# EAGLE design alles-pro (EAGLE 9.5.2)
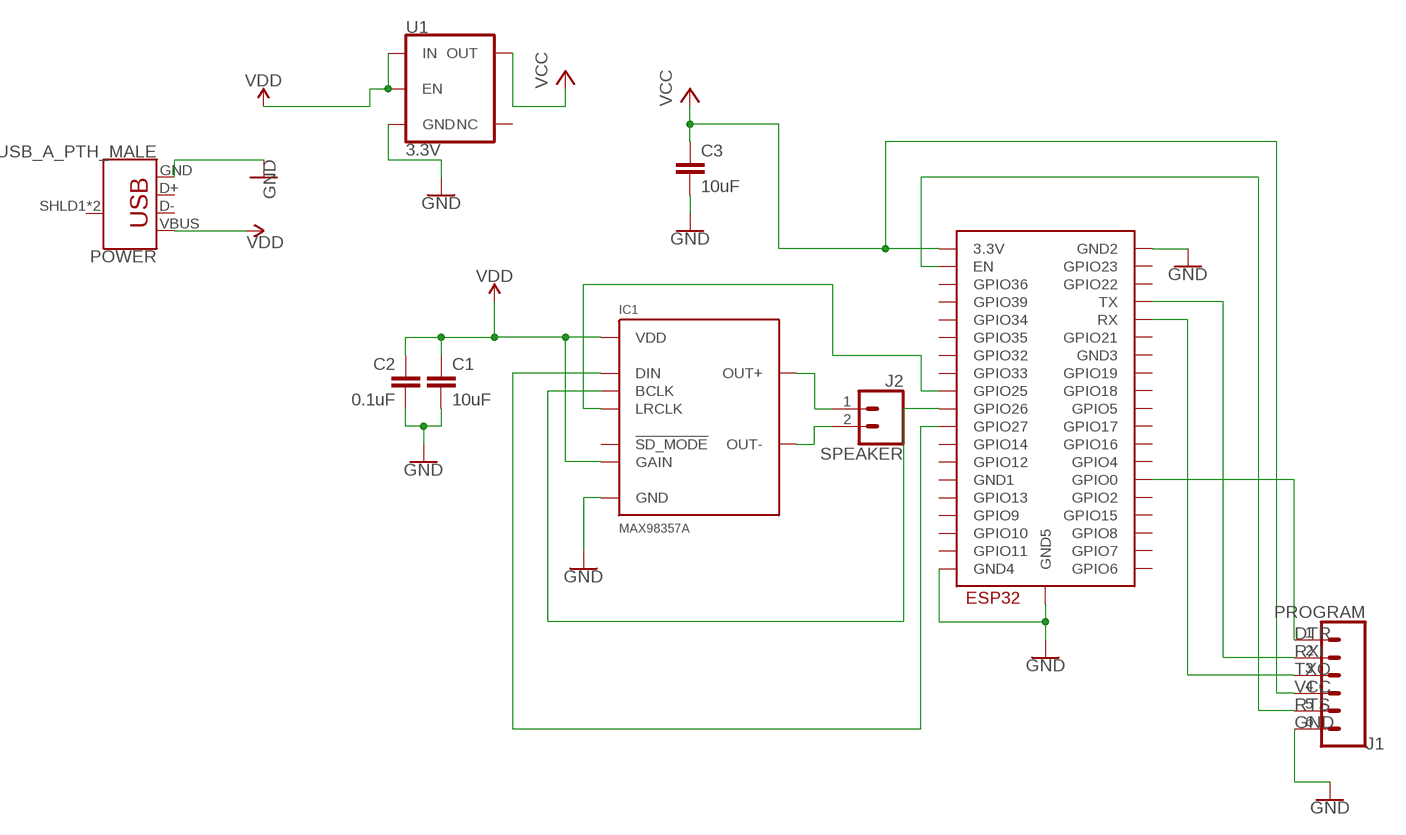
[diagram p0: schematic, sheet 1]

## Parts
C1  10uF  10UF-0805-10V-10%  [0805]
C2  0.1uF  0.1UF-0603-25V-(+80/-20%)  [0603]
C3  10uF  10UF-0603-6.3V-20%  [0603]
IC1  MAX98357A  [TQFN-16]
J1  PROGRAM  CONN_06SILK_FEMALE_PTH  [1X06]
POWER  USB_A_PTH_MALE  [USB-A-H]
SPEAKER  J2  CONN_023.5MM-NO_SILK  [SCREWTERMINAL-3.5MM-2-NS]
U1  3.3V  V_REG_AP2112K-3.3V  [SOT23-5]
U$21  ESP32-WROOM  [ESP32-WROOM]

## Nets
BCLK: IC1.P$16(BCLK) U$21.IO26(GPIO26)
DIN: IC1.P$1(DIN) U$21.IO27(GPIO27)
DTR: J1.1 U$21.IO0(GPIO0)
GND: C1.2 C2.2 C3.2 IC1.P$3(GND) IC1.P$11(GND) IC1.P$15(GND) IC1.P$EP(GND) J1.6 POWER.GND U1.2(GND) U$21.GND2 U$21.GND4 U$21.GND5
LRCLK: IC1.P$14(LRCLK) U$21.IO25(GPIO25)
OUT+: IC1.P$9(OUT+) SPEAKER.1
OUT-: IC1.P$10(OUT-) SPEAKER.2
RTS: J1.5 U$21.EN
RXI: J1.2 U$21.TX
TXO: J1.3 U$21.RX
VCC: C3.1 J1.4 U1.5(OUT) U$21.3V3(3.3V)
VDD: C1.1 C2.1 IC1.P$2(GAIN) IC1.P$7(VDD) IC1.P$8(VDD) POWER.VBUS U1.1(IN) U1.3(EN)
Unconnected: IC1.P$4(!SD_MODE) POWER.D+ POWER.D- POWER.SHLD1(SHIELD) POWER.SHLD2(SHIELD) U1.4(NC) U$21.CLK(GPIO6) U$21.CMD(GPIO11) U$21.GND1 U$21.GND3 U$21.IO2(GPIO2) U$21.IO4(GPIO4) U$21.IO5(GPIO5) U$21.IO12(GPIO12) U$21.IO13(GPIO13) U$21.IO14(GPIO14) U$21.IO15(GPIO15) U$21.IO16(GPIO16) U$21.IO17(GPIO17) U$21.IO18(GPIO18) U$21.IO19(GPIO19) U$21.IO21(GPIO21) U$21.IO22(GPIO22) U$21.IO23(GPIO23) U$21.IO32(GPIO32) U$21.IO33(GPIO33) U$21.IO34(GPIO34) U$21.IO35(GPIO35) U$21.SD0(GPIO7) U$21.SD1(GPIO8) U$21.SD2(GPIO9) U$21.SD3(GPIO10) U$21.SENSOR_VN(GPIO39) U$21.SENSOR_VP(GPIO36)

## Library data of the parts
C1 = SparkFun-Capacitors:10UF: 10.0µF ceramic capacitors A capacitor is a passive two-terminal electrical component used to store electrical energy temporarily in an electric field.; PROD_ID: CAP-11330
C2 = SparkFun-Capacitors:0.1UF: 0.1µF ceramic capacitors A capacitor is a passive two-terminal electrical component used to store electrical energy temporarily in an electric field.; PROD_ID: CAP-00810
C3 = SparkFun-Capacitors:10UF: 10.0µF ceramic capacitors A capacitor is a passive two-terminal electrical component used to store electrical energy temporarily in an electric field.; PROD_ID: CAP-11015
IC1 = SparkFun-IC-Amplifiers:MAX98357A: I2S DAC 3.2W (4-8ohm); PROD_ID: IC-14032
J1 = SparkFun-Connectors:CONN_06: Multi connection point. Often used as Generic Header-pin footprint for 0.1 inch spaced/style header connections On any of the 0.1 inch spaced packages, you can populate with these: Break Away Headers - Straight <https://www.sparkfun.com/products/116> (PRT-00116) Break Away Male Headers - Right Angle <https://www.sparkfun.com/products/553> (PRT-00553) Female Headers <https://www.sparkfun.com/products/115> (PRT-00115) Break Away Headers - Machine Pin <https://www.sparkfun.com/products/117> (PRT-00117) Break Away Female Headers - Swiss Machine Pin <https://www.sparkfun.com/products/743> (PRT-00743) Arduino Stackable Header - 6 Pin <https://www.sparkfun.com/products/9280> (PRT-09280) For SCREWTERMINALS and SPRING TERMINALS visit here: Screw Terimnals on SparkFun.com <https://www.sparkfun.com/search/results?term=Screw+Terminals> (5mm/3.5mm/2.54mm spacing) This device is also useful as a general connection point to wire up your design to another part of your project. Our various solder wires solder well into these plated through hole pads. Hook-Up Wire - Assortment (Stranded, 22 AWG) <https://www.sparkfun.com/products/11375> (PRT-11375) Hook-Up Wire - Assortment (Solid Core, 22 AWG) <https://www.sparkfun.com/products/11367> (PRT-11367) View the entire wire category on our website here <https://www.sparkfun.com/categories/141>; PROD_ID: CONN-08437
POWER = SparkFun-Connectors:USB_A: USB-A Connector Male and female variants, as well as PTH and SMT variants SparkFun Products: SparkFun XBee Explorer Dongle <https://www.sparkfun.com/products/11697> PTH Male SparkFun MicroView-USB Programmer <https://www.sparkfun.com/products/12924> SMT Male SparkFun USB Type A Female Breakout <https://www.sparkfun.com/products/12700> SMT Female; PROD_ID: CONN-08367; SF_ID: PRT-00437
SPEAKER = SparkFun-Connectors:CONN_02: Multi connection point. Often used as Generic Header-pin footprint for 0.1 inch spaced/style header connections On any of the 0.1 inch spaced packages, you can populate with these: Break Away Headers - Straight <https://www.sparkfun.com/products/116> (PRT-00116) Break Away Male Headers - Right Angle <https://www.sparkfun.com/products/553> (PRT-00553) Female Headers <https://www.sparkfun.com/products/115> (PRT-00115) Break Away Headers - Machine Pin <https://www.sparkfun.com/products/117> (PRT-00117) Break Away Female Headers - Swiss Machine Pin <https://www.sparkfun.com/products/743> (PRT-00743) For SCREWTERMINALS and SPRING TERMINALS visit here: Screw Terimnals on SparkFun.com <https://www.sparkfun.com/search/results?term=Screw+Terminals> (5mm/3.5mm/2.54mm spacing) This device is also useful as a general connection point to wire up your design to another part of your project. Our various solder wires solder well into these plated through hole pads. Hook-Up Wire - Assortment (Stranded, 22 AWG) <https://www.sparkfun.com/products/11375> (PRT-11375) Hook-Up Wire - Assortment (Solid Core, 22 AWG) <https://www.sparkfun.com/products/11367> (PRT-11367) View the entire wire category on our website here <https://www.sparkfun.com/categories/141> Special notes: Molex polarized connector foot print use with: PRT-08233 with associated crimp pins and housings. 2.54_SCREWTERM for use with PRT-10571. 3.5mm Screw Terminal footprints for PRT-08084 5mm Screw Terminal footprints for use with PRT-08432; PROD_ID: CONN-08399
U1 = SparkFun-IC-Power:V_REG_AP2112: AP2112 - 600mA CMOS LDO Regulator w/ Enable The AP2112 is CMOS process low dropout linear regulator with enable function, the regulator delivers a guaranteed 600mA (min.) continuous load current. Features Output Voltage Accuracy: ±1.5% Output Current: 600mA (Min.) Foldback Short Current Protection: 50mA Enable Function to Turn ON/OFF VOUT Low Dropout Voltage (3.3V): 250mV (Typ.) @IOUT=600mA Excellent Load Regulation: 0.2%/A (Typ.) Excellent Line Regulation: 0.02%/V (Typ.) Low Quiescent Current: 55μA (Typ.) Low Standby Current: 0.01μA (Typ.) Low Output Noise: 50μVRMS PSRR: 100Hz -65dB, 1kHz -65dB OTSD Protection Stable with 1.0μF Flexible Cap: Ceramic, Tantalum and Aluminum Electrolytic Operation Temperature Range: -40°C to 85°C ESD: MM 400V, HBM 4000V; PROD_ID: VREG-12457
U$21 = ESP32:ESP32-WROOM

## Board
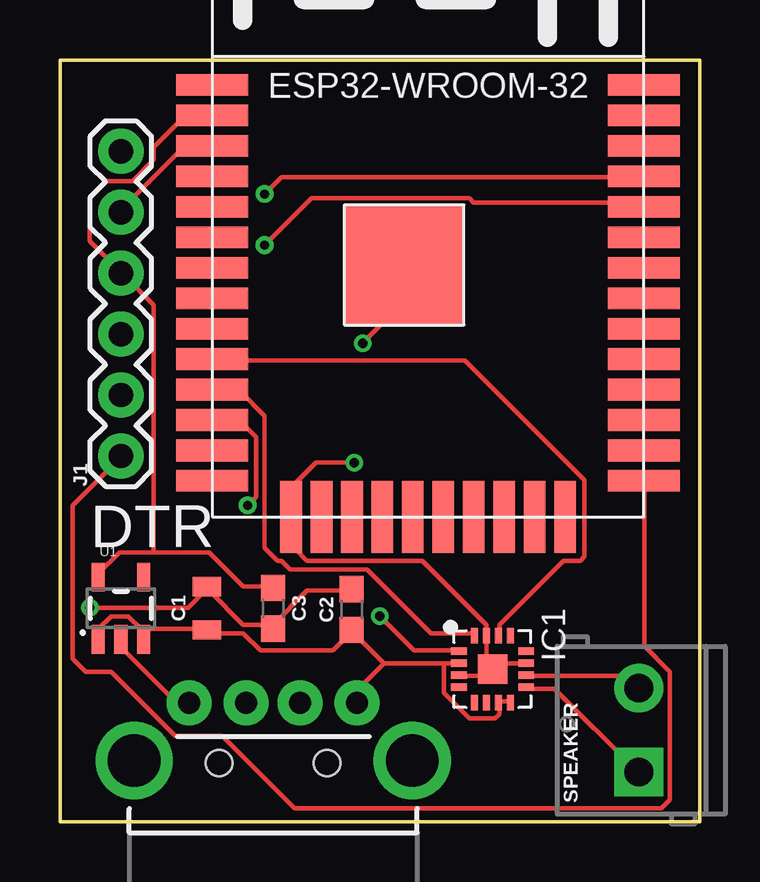
[diagram p1: board, top side]
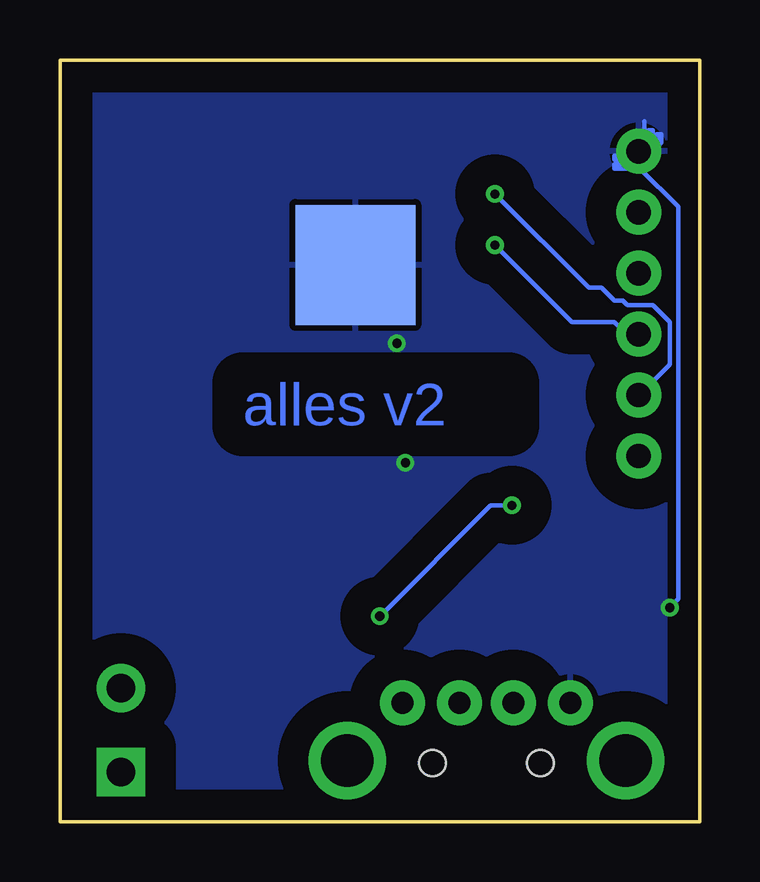
[diagram p2: board, bottom side, seen from below]

Size 26.67 x 31.75 mm. Coordinates in mm from the lower left corner, seen from the top.
Outline: 0,0 26.67,0 26.67,31.75 0,31.75 0,0
Copper layers (1*16): Top 0.035mm / dielectric 1.5mm / Bottom 0.035mm
Design rules "SparkFun-2-layer-TIGHT *": minimum track width 7mil, minimum drill 15mil, track to track 7mil, track to pad 7mil, pad to pad 7mil, via to via 7mil, smd to smd 7mil, copper to edge 7mil, drill to drill 7mil, minimum pad ring 7mil, minimum via ring 7mil, stop-mask expansion 4mil, vias tented up to drill 25mil, thermal gap 10mil

### Footprints (pad centres in the part's own frame; a part is rotated, then mirrored left to right if it is on the bottom)
0805 = smd 0.8 x 1.2: 1 -0.9,0; 2 0.9,0
0603 = smd 1.1 x 1: 1 -0.85,0; 2 0.85,0
TQFN-16 = smd 0.3 x 0.65: P$1 -0.75,-1.4; P$2 -0.25,-1.4; P$3 0.25,-1.4; P$4 0.75,-1.4; P$9 0.75,1.4; P$10 0.25,1.4; P$11 -0.25,1.4; P$12 -0.75,1.4 | smd 0.65 x 0.3: P$5 1.4,-0.75; P$6 1.4,-0.25; P$7 1.4,0.25; P$8 1.4,0.75; P$13 -1.4,0.75; P$14 -1.4,0.25; P$15 -1.4,-0.25; P$16 -1.4,-0.75 | smd 1.23 x 1.23: P$EP 0,0
1X06 = drill 1.016 pad 1.88: 1 0,0; 2 2.54,0; 3 5.08,0; 4 7.62,0; 5 10.16,0; 6 12.7,0
USB-A-H = drill 0.914 pad 1.88: D+ 2.4,1.127; D- 2.4,-1.127; GND 2.4,3.5; VBUS 2.4,-3.5 | drill 2.2: SHLD1 0,-5.8; SHLD2 0,5.8 | hole 1.1: -0.1,2.25; -0.1,-2.25
SCREWTERMINAL-3.5MM-2-NS = drill 1.2 pad 2.032 square: 1 0,0 | drill 1.2 pad 2.032: 2 3.5,0
SOT23-5 = smd 0.55 x 1.2: 1 -0.95,-1.3; 2 0,-1.3; 3 0.95,-1.3; 4 0.95,1.3; 5 -0.95,1.3
ESP32-WROOM = smd 3 x 0.9: 3V3 0,16.74; EN 0,15.47; GND1 0,18.01; GND3 18,18.01; IO0 18,1.5; IO4 18,2.77; IO5 18,6.58; IO12 0,1.5; IO14 0,2.77; IO16 18,4.04; IO17 18,5.31; IO18 18,7.85; IO19 18,9.12; IO21 18,11.66; IO22 18,15.47; IO23 18,16.74; IO25 0,6.58; IO26 0,5.31; IO27 0,4.04; IO32 0,9.12; IO33 0,7.85; IO34 0,11.66; IO35 0,10.39; NC 18,10.39; RX 18,12.93; SENSOR_VN 0,12.93; SENSOR_VP 0,14.2; TX 18,14.2 | smd 0.9 x 3: CLK 9.635,0; CMD 8.365,0; GND2 3.285,0; IO2 14.715,0; IO13 4.555,0; IO15 13.445,0; SD0 10.905,0; SD1 12.175,0; SD2 5.825,0; SD3 7.095,0 | smd 5 x 5: GND4 8,10.5 | smd 5 x 5 bottom: GND5 8,10.5

### Placement (x,y rotation side)
C1  6.12,8.89 90 top
C2  12.17,8.84 90 top
C3  8.89,8.89 270 top
IC1  18.03,6.35 270 top
J1  2.54,15.24 90 top
POWER  8.89,2.54 90 top
SPEAKER  24.13,2.06 90 top
U1  2.54,8.89 0 top
U$21  6.35,12.7 0 top

### Tracks (layer width: path | path; a pad name or v marks a point on that pad's centre or on a via)
BCLK
  Top 0.178: IC1.P$16 17.25,7.85 15.47,7.85 12.8,10.52 9.6,10.52 9.25,10.87 9.07,10.87 8.53,11.4 8.53,16.92 7.47,17.98 6.4,17.98 U$21.IO26
DIN  (via drill 0.38)
  Top 0.178: v13.34,8.56 14.76,7.14 16.54,7.14 IC1.P$1 | v7.82,13.18 8.18,13.54 8.18,16.03 7.47,16.74 6.4,16.74 U$21.IO27
  Bottom 0.178: v13.34,8.56 8.71,13.18 v7.82,13.18
DTR
  Top 0.178: U$21.IO0 24.36,14.07 24.36,7.32 25.43,6.25 25.43,0.91 25.07,0.56 9.78,0.56 6.76,3.58 4.8,3.58 2.13,6.25 1.07,6.25 0.53,6.78 0.53,13.18 2.49,15.14 J1.1
GND  (via drill 0.38)
  Top 0.178: IC1.P$3 16.71,6.07 17.78,6.07 17.96,6.25 IC1.P$EP | IC1.P$11 19.38,6.6 18.31,6.6 18.14,6.43 IC1.P$EP | IC1.P$EP 17.78,6.6 17.78,7.67 IC1.P$15 17.78,7.85 17.78,8.2 15.11,10.87 10.31,10.87 9.78,11.4 9.78,12.65 U$21.GND2 9.78,12.83 9.78,14.07 10.67,14.96 v12.27,14.96 | U1.2 2.67,7.49 2.67,7.14 4.8,5 5.33,5 POWER.GND | 8.89,8.2 7.64,8.2 6.22,9.63 C1.2 6.04,9.63 5.33,8.91 v1.25,8.91 | 8.89,8.2 10.31,9.63 12.09,9.63 C2.2 | 8.89,8.2 C3.2 | v12.62,19.94 14.22,21.54 14.22,23.14 U$21.GND4
  Bottom 0.178: v1.25,8.91 0.89,9.27 0.89,25.63 2.49,27.23 3.56,27.23 3.56,27.41 2.49,27.41 1.6,28.3 1.6,28.65 1.78,28.65 1.78,28.3 1.96,28.3 1.96,28.83 2.13,28.83 2.13,27.94 2.49,27.58 3.56,27.58 3.56,27.76 2.49,27.76 2.31,27.94 2.31,29.18 2.31,29.19
  pour Bottom (isolate 1.27): 0,31.75 26.67,31.75 26.67,0 0,0
LRCLK
  Top 0.178: IC1.P$14 18.31,7.85 18.31,8.2 20.98,10.87 21.69,10.87 21.87,11.05 21.87,14.25 16.89,19.23 6.4,19.23 U$21.IO25
OUT+
  Top 0.178: IC1.P$9 19.56,5.54 20.62,5.54 24,2.16 SPEAKER.1
OUT-
  Top 0.178: IC1.P$10 19.56,6.07 23.65,6.07 24,5.72 SPEAKER.2
RTS
  Top 0.178: U$21.EN 6.22,28.12 5.16,28.12 2.49,25.45 J1.5
RXI  (via drill 0.38)
  Top 0.178: v8.53,26.16 9.25,26.87 24.18,26.87 U$21.TX
  Bottom 0.178: v8.53,26.16 4.62,22.25 4.09,22.25 3.56,21.72 3.2,21.72 3.02,21.54 1.96,21.54 1.25,20.83 1.25,19.05 2.49,17.8 J1.2
TXO  (via drill 0.38)
  Top 0.178: v8.53,24.03 10.49,25.98 17.07,25.98 17.25,25.81 24.18,25.81 U$21.RX
  Bottom 0.178: v8.53,24.03 5.33,20.83 3.56,20.83 3.2,20.47 2.67,20.47 J1.3
VCC
  Top 0.178: 3.91,11.23 2.49,11.23 1.6,10.34 U1.5 | 3.91,11.23 6.22,11.23 7.64,9.8 8.89,9.8 C3.1 | U$21.3V3 6.22,29.36 5.16,29.36 3.91,28.12 3.91,27.58 3.02,26.69 1.96,26.69 1.25,25.98 1.25,24.21 2.49,22.96 J1.4 2.67,22.78 3.91,21.54 3.91,11.23
VDD
  Top 0.178: 3.38,8.03 2.85,8.56 2.13,8.56 1.6,8.03 1.6,7.67 U1.1 | 3.38,8.03 3.38,7.67 U1.3 3.38,8.03 | 3.38,8.03 6.04,8.03 C1.1 6.22,7.85 7.64,7.85 8.36,7.14 11.38,7.14 12.09,7.85 C2.1 12.27,7.85 13.51,6.6 | IC1.P$8 18.67,5 18.31,5 IC1.P$7 18.31,4.83 18.31,4.47 18.14,4.29 17.07,4.29 16,5.36 16,6.6 | 13.51,6.6 16,6.6 | 16,6.6 16.54,6.6 IC1.P$2 | 13.51,6.6 12.45,5.54 12.45,5 POWER.VBUS

### Text on the board
Bottom: alles v2
tNames: DTR
Measures: Units: Inches